# Altium schematic sheet 单片机.SchDoc
size A4
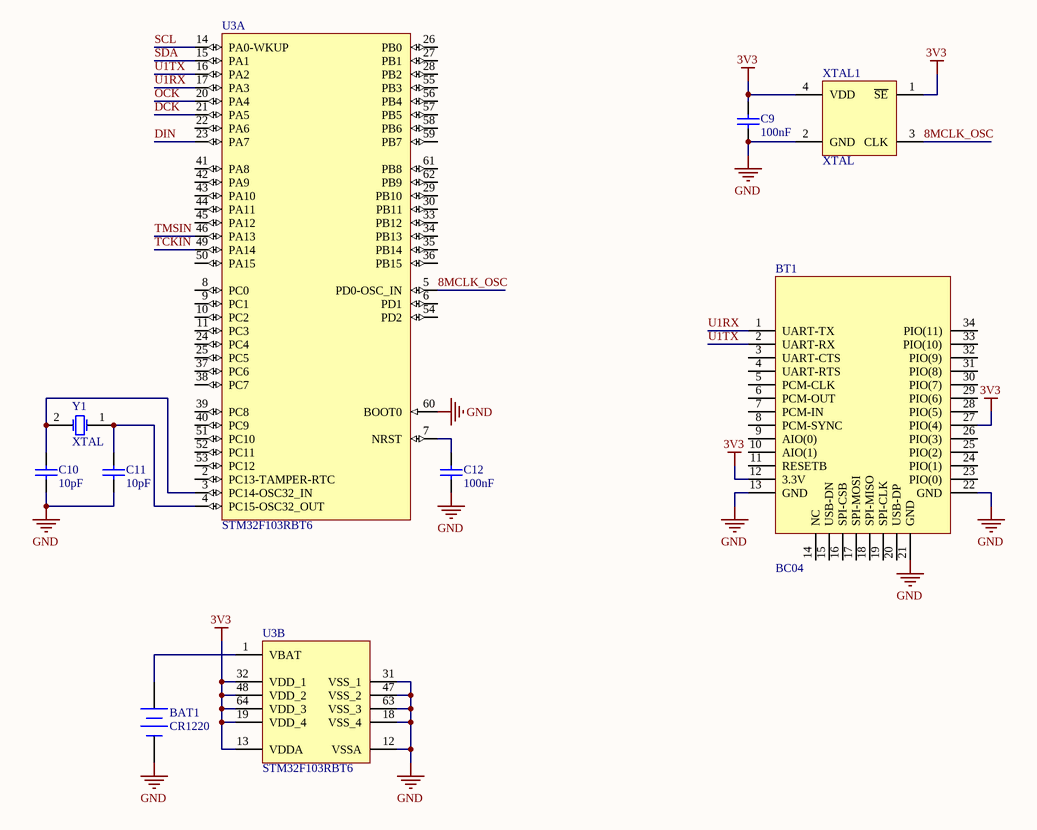
[diagram p0: 单片机.SchDoc]

## Parts
BAT1  CR1220  [BAT-CR1220]
BT1  BC04  [BC04]
C9  100nF  [0805]
C10  10pF  [0805]
C11  10pF  [0805]
C12  100nF  [0805]
U3  STM32F103RBT6  [LQFP-64]  (parts A,B of 2)
XTAL1  XTAL  [XTAL7050]
Y1  XTAL  [XTAL-32768]

## Nets
3V3: BT1.12(3.3V) BT1.27(PIO(4)) C9.2 U3.13(VDDA) U3.19(VDD_4) U3.32(VDD_1) U3.48(VDD_2) U3.64(VDD_3) XTAL1.1(~{SE}) XTAL1.4(VDD)
GND: BAT1.2(-) BT1.13(GND) BT1.21(GND) BT1.22(GND) C9.1 C10.1 C11.1 C12.2 U3.12(VSSA) U3.18(VSS_4) U3.31(VSS_1) U3.47(VSS_2) U3.60(BOOT0) U3.63(VSS_3) XTAL1.2(GND)
8MCLK_OSC: U3.5(PD0-OSC_IN) XTAL1.3(CLK)
DCK: U3.21(PA5)
DIN: U3.23(PA7)
OCK: U3.20(PA4)
SCL: U3.14(PA0-WKUP)
SDA: U3.15(PA1)
TCKIN: U3.49(PA14)
TMSIN: U3.46(PA13)
U1RX: BT1.1(UART-TX) U3.17(PA3)
U1TX: BT1.2(UART-RX) U3.16(PA2)
NetBAT1_1: BAT1.1(+) U3.1(VBAT)
NetC10_2: C10.2 U3.3(PC14-OSC32_IN) Y1.2(OSC2)
NetC11_2: C11.2 U3.4(PC15-OSC32_OUT) Y1.1(OSC1)
NetC12_1: C12.1 U3.7(NRST)

Not connected (* = marked no-connect by the designer): BT1 3(UART-CTS) 4(UART-RTS) 5(PCM-CLK) 6(PCM-OUT) 7(PCM-IN) 8(PCM-SYNC) 9(AIO(0)) 10(AIO(1)) 11(RESETB) 14(NC) 15(USB-DN) 16(SPI-CSB) 17(SPI-MOSI) 18(SPI-MISO) 19(SPI-CLK) 20(USB-DP) 23(PIO(0)) 24(PIO(1)) 25(PIO(2)) 26(PIO(3)) 28(PIO(5)) 29(PIO(6)) 30(PIO(7)) 31(PIO(8)) 32(PIO(9)) 33(PIO(10)) 34(PIO(11)); U3 2(PC13-TAMPER-RTC) 6(PD1) 8(PC0) 9(PC1) 10(PC2) 11(PC3) 22(PA6) 24(PC4) 25(PC5) 26(PB0) 27(PB1) 28(PB2) 29(PB10) 30(PB11) 33(PB12) 34(PB13) 35(PB14) 36(PB15) 37(PC6) 38(PC7) 39(PC8) 40(PC9) 41(PA8) 42(PA9) 43(PA10) 44(PA11) 45(PA12) 50(PA15) 51(PC10) 52(PC11) 53(PC12) 54(PD2) 55(PB3) 56(PB4) 57(PB5) 58(PB6) 59(PB7) 61(PB8) 62(PB9)

## Library data of the parts
BAT1 = Battery: Multicell Battery; Published: 24-Mar-1999; LatestRevisionDate: 17-Jul-2002; LatestRevisionNote: Re-released for DXP Platform.; PackageReference: BAT-2; Publisher: Altium Limited; PackageDescription: Battery; 2 Leads
C9-C12 = Cap: Capacitor; Value: 100pF; Published: 8-Jun-2000; LatestRevisionDate: 17-Jul-2002; LatestRevisionNote: Re-released for DXP Platform.; PackageReference: RAD-0.3; Publisher: Altium Limited; PackageDescription: Radial Cap, Thru-Hole; 2 Leads; 0.3 in Pin Spacing
U3 = STM32F103RBT6: STM32 ARM-based 32-bit MCU Performance Line with 128 kB Flash, 20 kB Internal RAM, -40 to +85癈 Temperature, 64-Pin LQFP, Tray; DatasheetVersion: rev13.0, Apr-2011; PackageVersion: rev13, Apr-2011; PackageReference: LQFP64; PackageDescription: 64-Pin Low-Profile Quad Flat Pack, 10 x 10 mm Body, 0.5 mm Pitch (LQFP64); ComponentLink1Description: Manufacturer URL; ComponentLink1URL: http://www.st.com/; ComponentLink2Description: STM32F103 Datasheet; ComponentLink2URL: http://www.st.com/internet/com/TECHNICAL_RESOURCES/TECHNICAL_LITERATURE/DATASHEET/CD00161566.pdf; ComponentLink3Description: STM32 Family Web Page; ComponentLink3URL: www.st.com/stm32
XTAL1 = XTAL_SMD
Y1 = XTAL: Crystal Oscillator; Published: 8-Jun-2000; LatestRevisionDate: 17-Jul-2002; LatestRevisionNote: Re-released for DXP Platform.; PackageReference: R38; Publisher: Altium Limited; PackageDescription: Crystal, Thru-Hole; 2 Leads; Body 3.1 x 8.2 mm (Dia.xH)